# Altium schematic sheet power.SchDoc
size A4
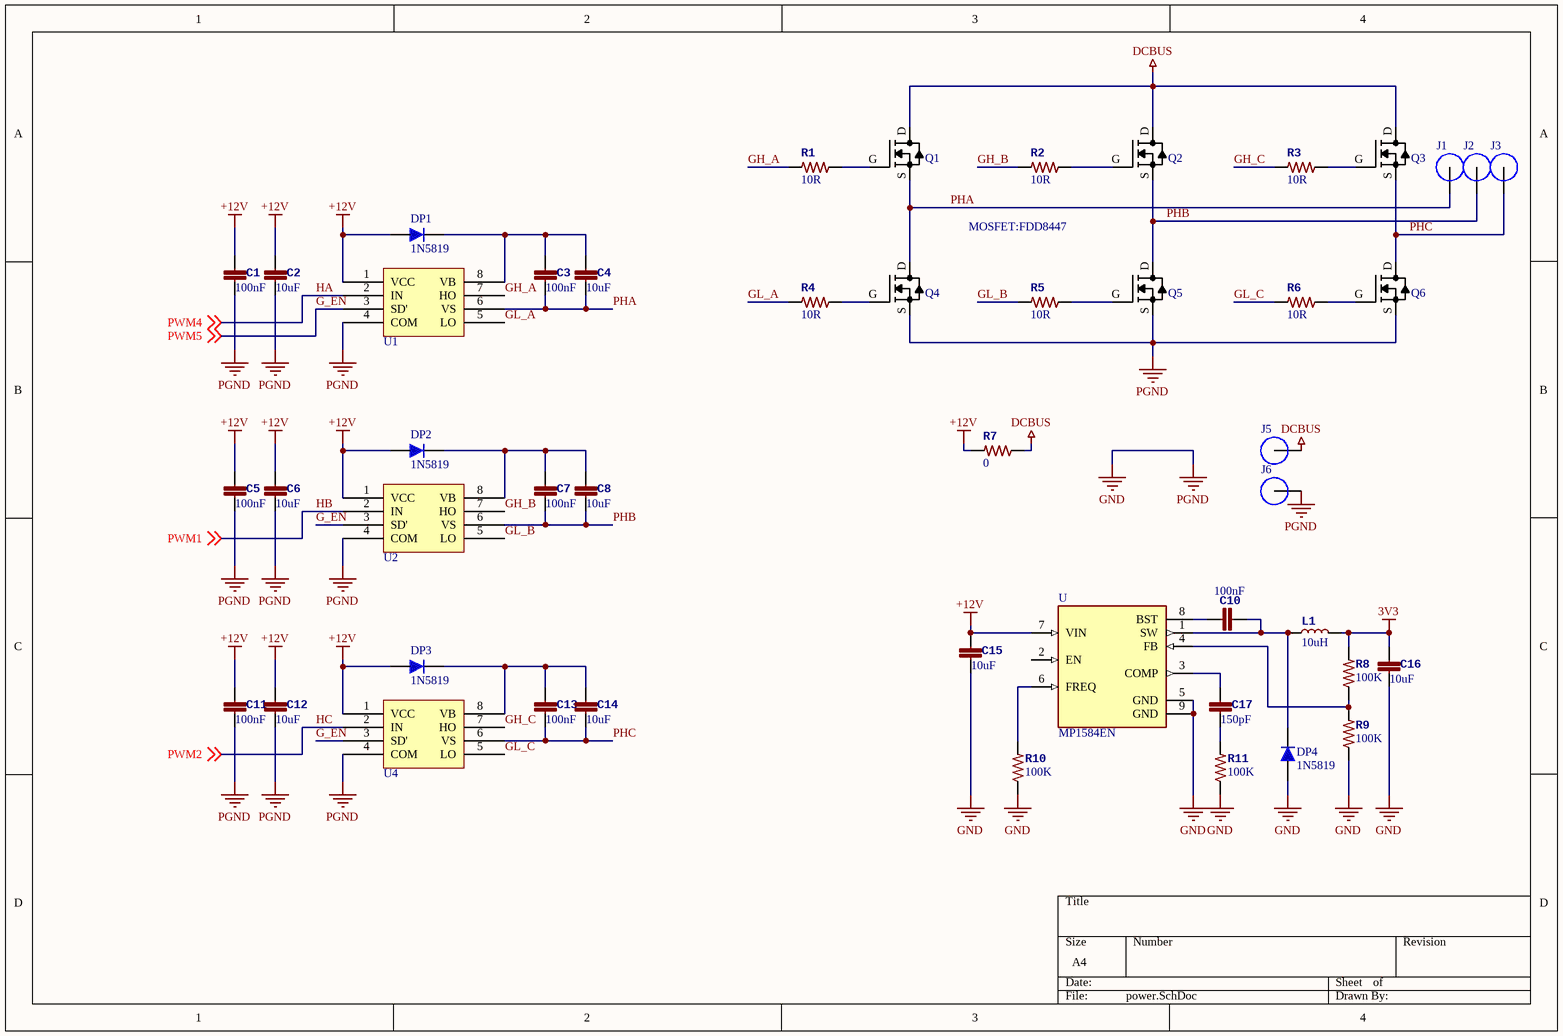
[diagram p0: power.SchDoc]

## Parts
C1  value 100nF  [_1206]  (hidden comment: Cap)
C2  value 10uF  [_1206]  (hidden comment: Cap)
C3  value 100nF  [_1206]  (hidden comment: Cap)
C4  value 10uF  [_1206]  (hidden comment: Cap)
C5  value 100nF  [_1206]  (hidden comment: Cap)
C6  value 10uF  [_1206]  (hidden comment: Cap)
C7  value 100nF  [_1206]  (hidden comment: Cap)
C8  value 10uF  [_1206]  (hidden comment: Cap)
C10  value 100nF  [_0805]  (hidden comment: Cap)
C11  value 100nF  [_1206]  (hidden comment: Cap)
C12  value 10uF  [_1206]  (hidden comment: Cap)
C13  value 100nF  [_1206]  (hidden comment: Cap)
C14  value 10uF  [_1206]  (hidden comment: Cap)
C15  value 10uF  [_1206]  (hidden comment: Cap)
C16  value 10uF  [_1206]  (hidden comment: Cap)
C17  value 150pF  [_0805]  (hidden comment: Cap)
DP1  1N5819  [430X270D]
DP2  1N5819  [430X270D]
DP3  1N5819  [430X270D]
DP4  1N5819  [430X270D]
J1  (no value)  [M3 Spade Hole]
J2  (no value)  [M3 Spade Hole]
J3  (no value)  [M3 Spade Hole]
J5  (no value)  [M3 Spade Hole]
J6  (no value)  [M3 Spade Hole]
L1  value 10uH  [_INDUCTOR-SMD-6.0mm]  (hidden comment: Inductor)
Q1  FILL_FOOTPRINT  [TO229P994X240-3N]  (value not drawn)
Q2  FILL_FOOTPRINT  [TO229P994X240-3N]  (value not drawn)
Q3  FILL_FOOTPRINT  [TO229P994X240-3N]  (value not drawn)
Q4  FILL_FOOTPRINT  [TO229P994X240-3N]  (value not drawn)
Q5  FILL_FOOTPRINT  [TO229P994X240-3N]  (value not drawn)
Q6  FILL_FOOTPRINT  [TO229P994X240-3N]  (value not drawn)
R1  value 10R  [_0805]  (hidden comment: Resistor)
R2  value 10R  [_0805]  (hidden comment: Resistor)
R3  value 10R  [_0805]  (hidden comment: Resistor)
R4  value 10R  [_0805]  (hidden comment: Resistor)
R5  value 10R  [_0805]  (hidden comment: Resistor)
R6  value 10R  [_0805]  (hidden comment: Resistor)
R7  value 0  [_1206]  (hidden comment: Resistor)
R8  value 100K  [_0805]  (hidden comment: Resistor)
R9  value 100K  [_0805]  (hidden comment: Resistor)
R10  value 100K  [_0805]  (hidden comment: Resistor)
R11  value 100K  [_0805]  (hidden comment: Resistor)
U  MP1584EN  [SOIC127P600X170-9N]
U1  IR2104  [_SO08]  (value not drawn)
U2  IR2104  [_SO08]  (value not drawn)
U4  IR2104  [_SO08]  (value not drawn)

## Nets
3V3: C16.1 L1.2 R8.2
+12V: C1.1 C2.1 C5.1 C6.1 C11.1 C12.1 C15.1 DP1.1 DP2.1 DP3.1 R7.2 U.7(VIN) U1.1(VCC) U2.1(VCC) U4.1(VCC)
DCBUS: J5.1 Q1.D Q2.D Q3.D R7.1
GND: C1.2 C2.2 C5.2 C6.2 C11.2 C12.2 C15.2 C16.2 DP4.1 J6.1 Q4.S Q5.S Q6.S R9.1 R10.1 R11.1 U.5(GND) U.9(GND) U1.4(COM) U2.4(COM) U4.4(COM)  [also labelled PGND]
G_EN: U1.3(SD') U2.3(SD') U4.3(SD') ; off-sheet PWM5  [also labelled PWM5]
GH_A: R1.2 U1.7(HO)
GH_B: R2.2 U2.7(HO)
GH_C: R3.2 U4.7(HO)
GL_A: R4.2 U1.5(LO)
GL_B: R5.2 U2.5(LO)
GL_C: R6.2 U4.5(LO)
HA: U1.2(IN) ; off-sheet PWM4  [also labelled PWM4]
HB: U2.2(IN) ; off-sheet PWM1  [also labelled PWM1]
HC: U4.2(IN) ; off-sheet PWM2  [also labelled PWM2]
PHA: C3.2 C4.2 J1.1 Q1.S Q4.D U1.6(VS)
PHB: C7.2 C8.2 J2.1 Q2.S Q5.D U2.6(VS)
PHC: C13.2 C14.2 J3.1 Q3.S Q6.D U4.6(VS)
NetC3_1: C3.1 C4.1 DP1.2 U1.8(VB)
NetC7_1: C7.1 C8.1 DP2.2 U2.8(VB)
NetC10_1: C10.1 U.8(BST)
NetC10_2: C10.2 DP4.2 L1.1 U.1(SW)
NetC13_1: C13.1 C14.1 DP3.2 U4.8(VB)
NetC17_1: C17.1 U.3(COMP)
NetC17_2: C17.2 R11.2
NetQ1_G: Q1.G R1.1
NetQ2_G: Q2.G R2.1
NetQ3_G: Q3.G R3.1
NetQ4_G: Q4.G R4.1
NetQ5_G: Q5.G R5.1
NetQ6_G: Q6.G R6.1
NetR8_1: R8.1 R9.2 U.4(FB)
NetR10_2: R10.2 U.6(FREQ)

Not connected (* = marked no-connect by the designer): U 2(EN)

## Notes on the sheet
- MOSFET:FDD8447

## Library data of the parts
C1-C8 C10-C17 = Cap_1
DP1-DP4 = 1N5819: Schottkey Rectifiers; Designer: Abbas Basereh; Data: 16-12-2016; Link: *; Part. No: *
J1-J3 J5 J6 = M3 Spade Terminal
Q1-Q6 = NTMFS4935NT1G: MOSFET N-CH 30V 13A SO8FL; Manufacturer: ON Semiconductor; FET Type: N-Channel; Current - Continuous Drain (Id) @ 25°C: 13A (Ta), 93A (Tc); Drive Voltage (Max Rds On,  Min Rds On): 4.5V, 10V; Vgs(th) (Max) @ Id: 2.2V @ 250µA; Gate Charge (Qg) (Max) @ Vgs: 49.4nC @ 10V; Input Capacitance (Ciss) (Max) @ Vds: 4850pF @ 15V; Vgs (Max): ±20V; Power Dissipation (Max): 930mW (Ta), 48W (Tc); Rds On (Max) @ Id, Vgs: 3.2 mOhm @ 30A, 10V; Supplier 1: Digi-Key; Supplier Part Number 1: NTMFS4935NT1GOSCT-ND; RoHS: RoHS Compliant; Category: Discrete Semiconductor Products; Stock 1: 932; Pricing 1: 1=0.61, 10=0.541, 100=0.4145, 500=0.3277 (USD); Packaging: Cut Tape (CT); Part Status: Active; Technology: MOSFET (Metal Oxide); Drain to Source Voltage (Vdss): 30V; FET Feature: -; Operating Temperature: -55°C ~ 150°C (TJ); Mounting Type: Surface Mount; Supplier Device Package: 5-DFN (5x6) (8-SOFL); Package / Case: 8-PowerTDFN, 5 Leads; ComponentLink1URL: http://www.onsemi.com/pub_link/Collateral/NTMFS4935N-D.PDF; ComponentLink1Description: http://www.onsemi.com/pub_link/Collateral/NTMFS4935N-D.PDF; Manufacturer Part Number: NTMFS4935NT1G
U = MP1584EN: Buck Switching Regulator IC Positive Adjustable 0.8V 1 Output 3A 8-SOIC _0.154, 3.90mm Width_ Exposed Pad; MF: Monolithic Power; MP: MP1584EN; Value: *; Package: SOIC-8 Monolithic Power; SnapEDA_Link: https://www.snapeda.com/parts/MP1584EN/Monolithic%20Power%20Systems%20Inc./view-part/891721/?ref=snap; Price: None; Availability: Unavailable